# EAGLE schematic headlamp_v11-3 (EAGLE 6.4)

## Sheet 1 of 2
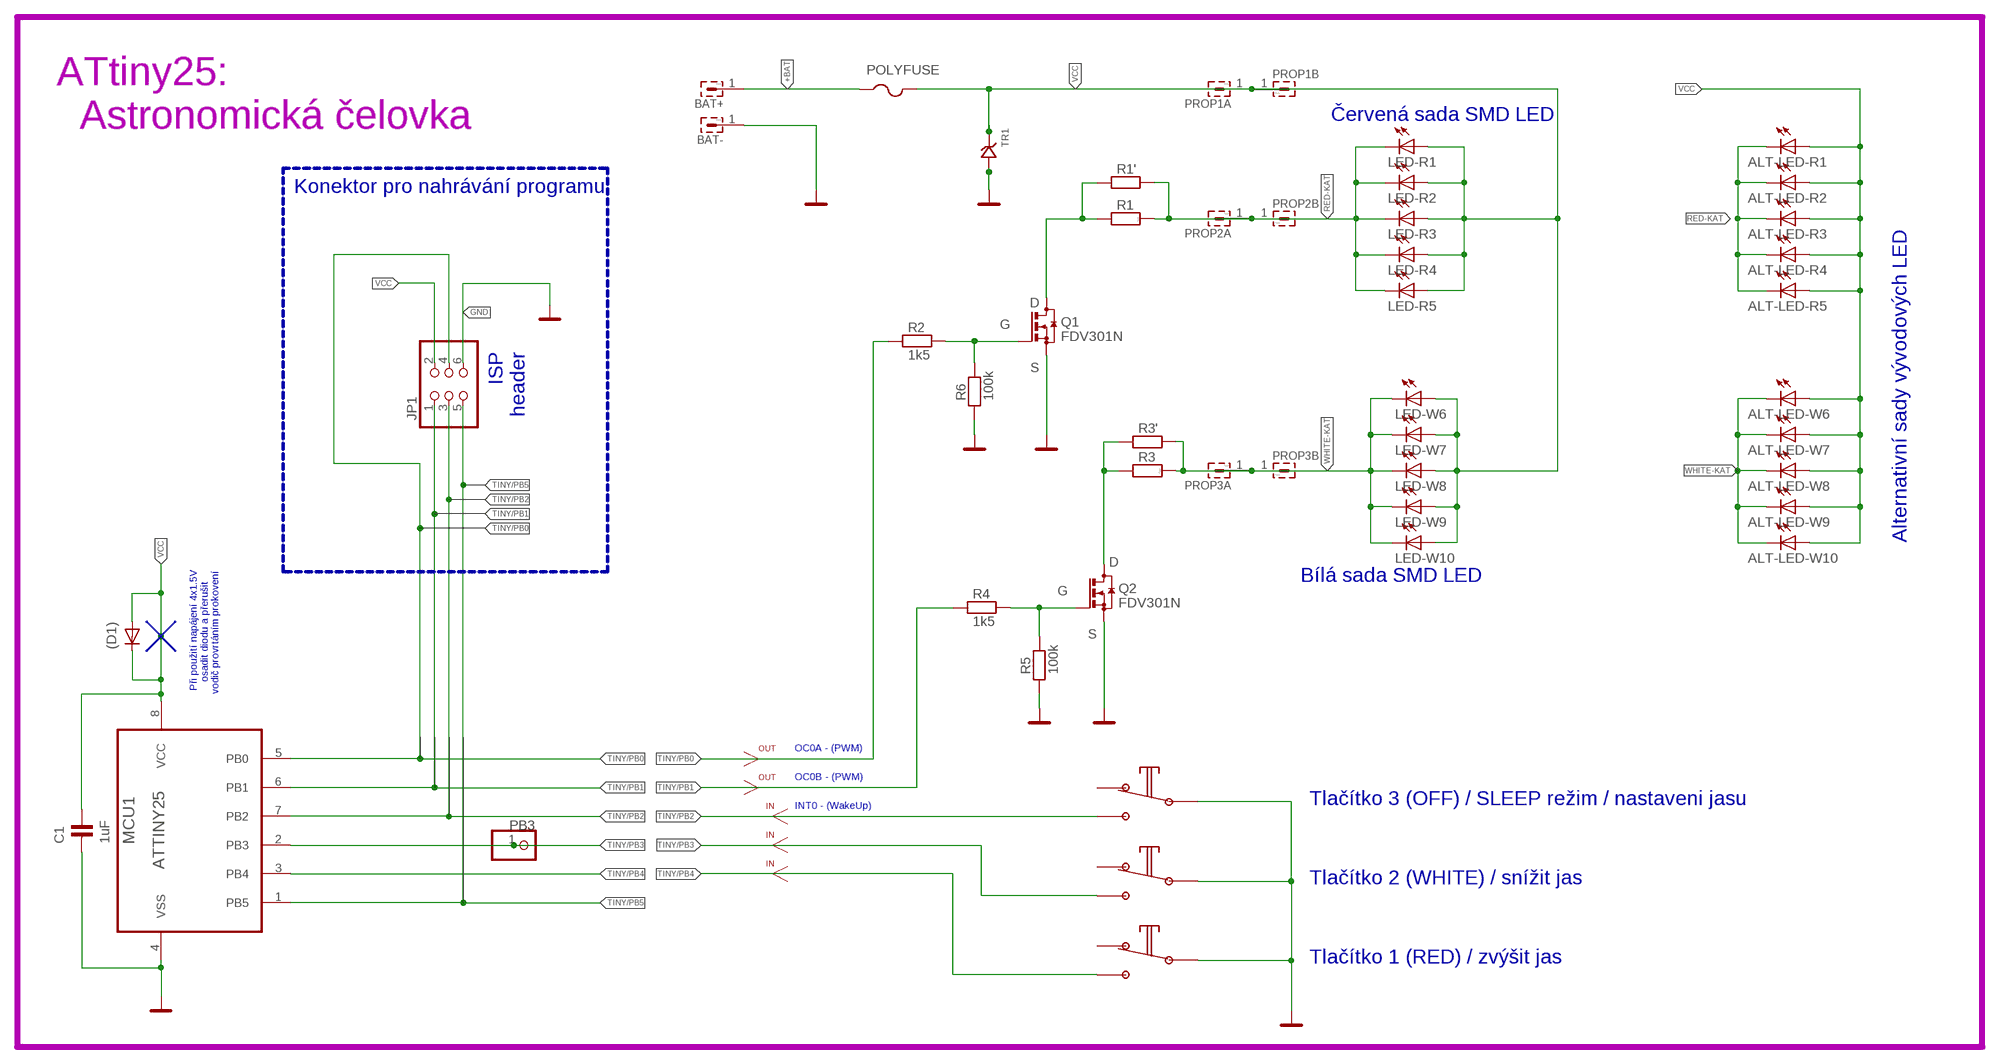
[diagram p0: schematic, sheet 1]

### Parts
(D1)  DIODE-MINIMELF  [MINIMELF]
ALT-LED-R1  LED3MM  [LED3MM]
ALT-LED-R2  LED3MM  [LED3MM]
ALT-LED-R3  LED3MM  [LED3MM]
ALT-LED-R4  LED3MM  [LED3MM]
ALT-LED-R5  LED3MM  [LED3MM]
ALT-LED-W6  LED3MM  [LED3MM]
ALT-LED-W7  LED3MM  [LED3MM]
ALT-LED-W8  LED3MM  [LED3MM]
ALT-LED-W9  LED3MM  [LED3MM]
ALT-LED-W10  LED3MM  [LED3MM]
BAT+  S1G1_JUMP  [S1G1_JUM]
BAT-  S1G1_JUMP  [S1G1_JUM]
C1  1uF  C-KERAMIK_SMD_0805  [0805]
JP1  PINHD-2X3/90  [2X03/90]
LED-R1  LEDCHIP-LED0805  [CHIP-LED0805]
LED-R2  LEDCHIP-LED0805  [CHIP-LED0805]
LED-R3  LEDCHIP-LED0805  [CHIP-LED0805]
LED-R4  LEDCHIP-LED0805  [CHIP-LED0805]
LED-R5  LEDCHIP-LED0805  [CHIP-LED0805]
LED-W6  LEDCHIP-LED0805  [CHIP-LED0805]
LED-W7  LEDCHIP-LED0805  [CHIP-LED0805]
LED-W8  LEDCHIP-LED0805  [CHIP-LED0805]
LED-W9  LEDCHIP-LED0805  [CHIP-LED0805]
LED-W10  LEDCHIP-LED0805  [CHIP-LED0805]
MCU1  ATTINY25  ATTINY13  [SOIC127P600X175-8N]
PB3  PINHD-1X1  [1X01]
POLYFUSE  PTCFUSE-1812  [1812]
PROP1A  S1G1_JUMP  [S1G1_JUM]
PROP1B  S1G1_JUMP  [S1G1_JUM]
PROP2A  S1G1_JUMP  [S1G1_JUM]
PROP2B  S1G1_JUMP  [S1G1_JUM]
PROP3A  S1G1_JUMP  [S1G1_JUM]
PROP3B  S1G1_JUMP  [S1G1_JUM]
Q1  FDV301N  BSS123  [SOT23]
Q2  FDV301N  BSS123  [SOT23]
R1  R_1206  [1206]
R1'  R_SMD_0805  [0805]
R2  1k5  R_SMD_0805  [0805]
R3  R_1206  [1206]
R3'  R_SMD_0805  [0805]
R4  1k5  R_SMD_0805  [0805]
R5  100k  R_SMD_0805  [0805]
R6  100k  R_SMD_0805  [0805]
TLAC1  TLACITKO  [TLACITKO]
TLAC2  TLACITKO  [TLACITKO]
TLAC3  TLACITKO  [TLACITKO]
TR1  Transil 6V  SMAJ30CA-TR__DO214AC+MINIMELF  [DO214AC+MINIMELF_BIDIR]

### Nets
+BAT: BAT+.1 POLYFUSE.1
GND: BAT-.1 C1.2 JP1.6 MCU1.4(VSS) Q1.2(S) Q2.2(S) R5.1 R6.1 TLAC1.P$1(COM) TLAC2.P$1(COM) TLAC3.P$1(COM) TR1.P$2
RED-DRAIN: Q1.3(D) R1'.2 R1.1
RED-KAT: ALT-LED-R1.K(C) ALT-LED-R2.K(C) ALT-LED-R3.K(C) ALT-LED-R4.K(C) ALT-LED-R5.K(C) LED-R1.C LED-R2.C LED-R3.C LED-R4.C LED-R5.C PROP2A.1 PROP2B.1 R1'.1 R1.2
RED/GATE: Q1.1(G) R2.2 R6.2
TINY/PB0: JP1.4 MCU1.5(PB0) R2.1
TINY/PB1: JP1.1 MCU1.6(PB1) R4.1
TINY/PB2: JP1.3 MCU1.7(PB2) TLAC3.P$2(NO)
TINY/PB3: MCU1.2(PB3) PB3.1 TLAC2.P$2(NO)
TINY/PB4: MCU1.3(PB4) TLAC1.P$2(NO)
TINY/PB5: JP1.5 MCU1.1(PB5)
VCC: (D1).A (D1).C ALT-LED-R1.A ALT-LED-R2.A ALT-LED-R3.A ALT-LED-R4.A ALT-LED-R5.A ALT-LED-W6.A ALT-LED-W7.A ALT-LED-W8.A ALT-LED-W9.A ALT-LED-W10.A C1.1 JP1.2 LED-R1.A LED-R2.A LED-R3.A LED-R4.A LED-R5.A LED-W6.A LED-W7.A LED-W8.A LED-W9.A LED-W10.A MCU1.8(VCC) POLYFUSE.2 PROP1A.1 PROP1B.1 TR1.P$1
WHITE-DRAIN: Q2.3(D) R3'.2 R3.1
WHITE-KAT: ALT-LED-W6.K(C) ALT-LED-W7.K(C) ALT-LED-W8.K(C) ALT-LED-W9.K(C) ALT-LED-W10.K(C) LED-W6.C LED-W7.C LED-W8.C LED-W9.C LED-W10.C PROP3A.1 PROP3B.1 R3'.1 R3.2
WHITE/GATE: Q2.1(G) R4.2 R5.2
Unconnected: TLAC1.P$3(NC) TLAC2.P$3(NC) TLAC3.P$3(NC)

### Buses
B$4
B$1
B$2

### Notes on the sheet
- Červená sada SMD LED
- ATtiny25:
    Astronomická čelovka
- Konektor pro nahrávání programu
- Alternativní sady vývodových LED
- D
- G
- ISP
  header
- S
- D
- Bílá sada SMD LED
- G
- S
- Při použití napájení 4x1.5V
      osadit diodu a přerušit
  vodič provrtáním prokovení
- OUT | OC0A - (PWM)
- OUT | OC0B - (PWM)
- Tlačítko 3 (OFF) / SLEEP režim / nastaveni jasu
- IN | INT0 - (WakeUp)
- IN
- IN
- Tlačítko 2 (WHITE) / snížit jas
- Tlačítko 1 (RED) / zvýšit jas

## Sheet 2 of 2

## Library data of the parts
(D1) = diode:DIODE-: DIODE
ALT-LED-R1-ALT-LED-R5 ALT-LED-W6-ALT-LED-W10 LED-R1-LED-R5 LED-W6-LED-W10 = led:LED: LED OSRAM: - CHIPLED LG R971, LG N971, LY N971, LG Q971, LY Q971, LO R971, LY R971 LH N974, LH R974 LS Q976, LO Q976, LY Q976 LO Q996 - Hyper CHIPLED LW Q18S LB Q993, LB Q99A, LB R99A - SideLED LS A670, LO A670, LY A670, LG A670, LP A670 LB A673, LV A673, LT A673, LW A673 LH A674 LY A675 LS A676, LA A676, LO A676, LY A676, LW A676 LS A679, LY A679, LG A679 - Hyper Micro SIDELED® LS Y876, LA Y876, LO Y876, LY Y876 LT Y87S - SmartLED LW L88C, LW L88S LB L89C, LB L89S, LG L890 LS L89K, LO L89K, LY L89K LS L896, LA L896, LO L896, LY L896 - TOPLED LS T670, LO T670, LY T670, LG T670, LP T670 LSG T670, LSP T670, LSY T670, LOP T670, LYG T670 LG T671, LOG T671, LSG T671 LB T673, LV T673, LT T673, LW T673 LH T674 LS T676, LA T676, LO T676, LY T676, LB T676, LH T676, LSB T676, LW T676 LB T67C, LV T67C, LT T67C, LS T67K, LO T67K, LY T67K, LW E67C LS E67B, LA E67B, LO E67B, LY E67B, LB E67C, LV E67C, LT E67C LW T67C LS T679, LY T679, LG T679 LS T770, LO T770, LY T770, LG T770, LP T770 LB T773, LV T773, LT T773, LW T773 LH T774 LS E675, LA E675, LY E675, LS T675 LS T776, LA T776, LO T776, LY T776, LB T776 LHGB T686 LT T68C, LB T68C - Hyper Mini TOPLED® LB M676 - Mini TOPLED Santana® LG M470 LS M47K, LO M47K, LY M47K Source: http://www.osram.convergy.de LUXEON: - LUMILED® LXK2-PW12-R00, LXK2-PW12-S00, LXK2-PW14-U00, LXK2-PW14-V00 LXK2-PM12-R00, LXK2-PM12-S00, LXK2-PM14-U00 LXK2-PE12-Q00, LXK2-PE12-R00, LXK2-PE12-S00, LXK2-PE14-T00, LXK2-PE14-U00 LXK2-PB12-K00, LXK2-PB12-L00, LXK2-PB12-M00, LXK2-PB14-N00, LXK2-PB14-P00, LXK2-PB14-Q00 LXK2-PR12-L00, LXK2-PR12-M00, LXK2-PR14-Q00, LXK2-PR14-R00 LXK2-PD12-Q00, LXK2-PD12-R00, LXK2-PD12-S00 LXK2-PH12-R00, LXK2-PH12-S00 LXK2-PL12-P00, LXK2-PL12-Q00, LXK2-PL12-R00 Source: www.luxeon.com KINGBRIGHT: KA-3528ASYC Source: www.kingbright.com
BAT+ BAT- PROP1A PROP1B PROP2A PROP2B PROP3A PROP3B = sirsi_pin:S1G1_JUMP: Radove konektory - koliky - 1x
C1 = #PaJa_30:C-KERAMIK: Kondenzator - keramicky
JP1 = pinhead:PINHD-2X3: PIN HEADER
MCU1 = ATTiny-SOIC8:ATTINY13: ATTINY13; PACKAGE: SOIC-8
PB3 = pinhead:PINHD-1X1: PIN HEADER
POLYFUSE = adafruit:PTCFUSE: PTC fuses, resettable thermistors
Q1 Q2 = transistor-small-signal:BSS123: N-CHANNEL MOS FET
R1 R3 = #PaJa_31:R: Rezistor
R1' R2 R3' R4-R6 = #PaJa_30:R: Rezistor
TLAC1-TLAC3 = tlacitko-L:TLACITKO: Tlacitko R2F - x x L A
TR1 = transil:SMAJ30CA-TR__DO214AC+MINIMELF: Transil SMAJ 30 Volt BIDIR. DO214AC+MINIMELF Package.